# Altium project EPS_PCB.PrjPcb
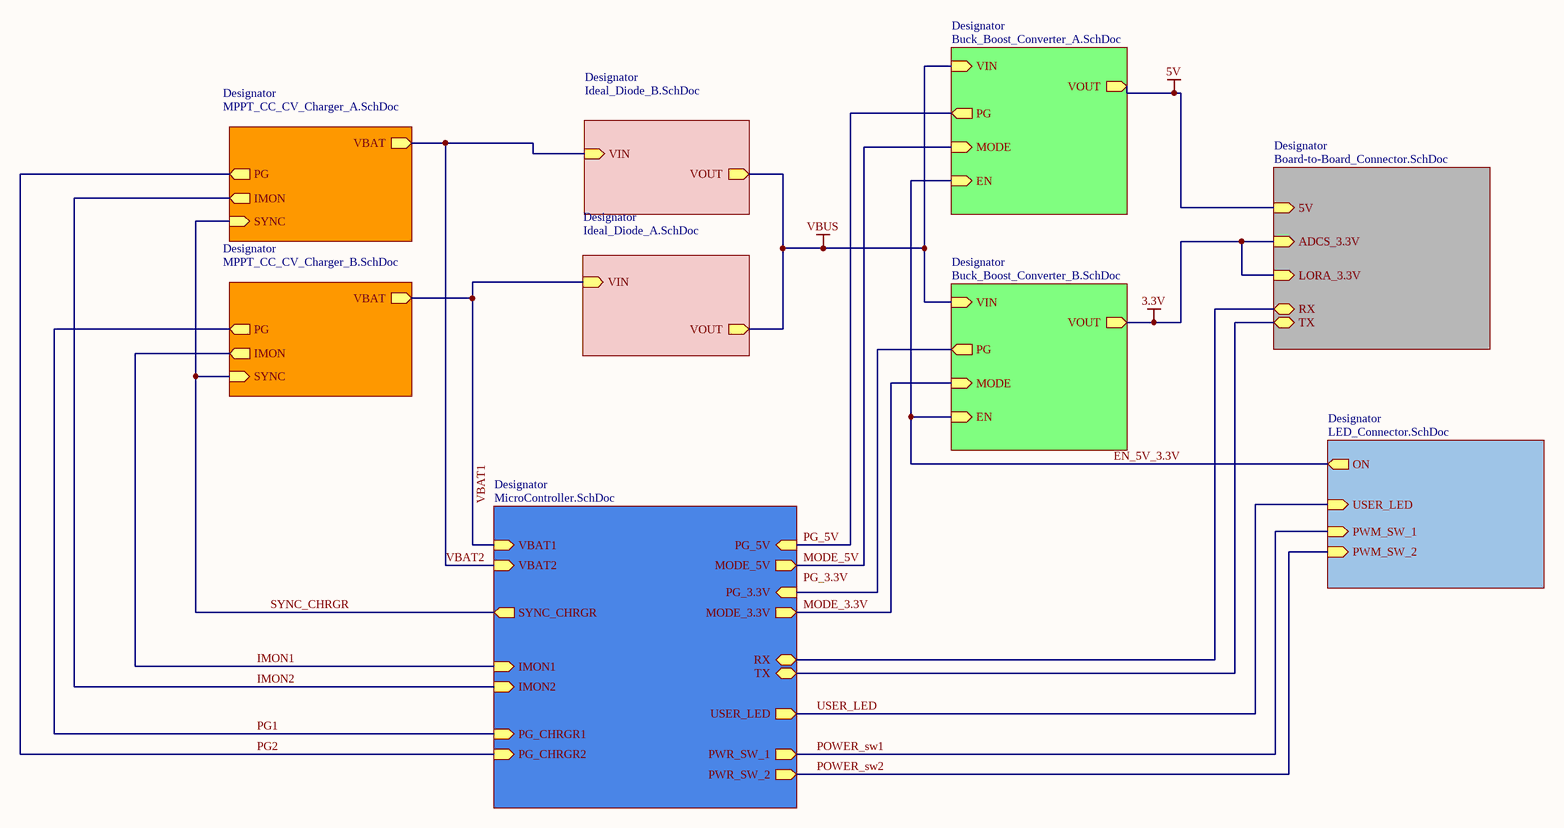
[diagram p0: Electrical_Power_System.SchDoc]
10 sheets, 119 parts. Net scope: hierarchical (ports join the sheet entries above them; power ports are global).
Board file: PCB1.PcbDoc
Sheets:
  Electrical_Power_System.SchDoc
    Designator = Board-to-Board_Connector.SchDoc
    Designator = MPPT_CC_CV_Charger_A.SchDoc
    Designator = Ideal_Diode_B.SchDoc
    Designator = Ideal_Diode_A.SchDoc
    Designator = Buck_Boost_Converter_B.SchDoc
    Designator = LED_Connector.SchDoc
    Designator = MicroController.SchDoc
    Designator = Buck_Boost_Converter_A.SchDoc
    Designator = MPPT_CC_CV_Charger_B.SchDoc

## Sheet Electrical_Power_System.SchDoc
size 431 x 279 mm; SheetNumber: 1; SheetTotal: 10

### Sub-sheets
Designator = Board-to-Board_Connector.SchDoc: 5V (in), ADCS_3.3V (in), LORA_3.3V (in), RX (bidir), TX (bidir)
Designator = MPPT_CC_CV_Charger_A.SchDoc: PG (out), IMON (out), SYNC (in), VBAT (out)
Designator = Ideal_Diode_B.SchDoc: VIN (in), VOUT (out)
Designator = Ideal_Diode_A.SchDoc: VIN (in), VOUT (out)
Designator = Buck_Boost_Converter_B.SchDoc: VIN (in), PG (out), MODE (in), EN (in), VOUT (out)
Designator = LED_Connector.SchDoc: ON (out), USER_LED (in), PWM_SW_1 (in), PWM_SW_2 (in)
Designator = MicroController.SchDoc: TX (bidir), RX (bidir), VBAT1 (in), VBAT2 (in), SYNC_CHRGR (out), IMON1 (in), IMON2 (in), PG_CHRGR1 (in), PG_CHRGR2 (in), PG_5V (in), MODE_5V (out), PG_3.3V (in), MODE_3.3V (out), USER_LED (out), PWR_SW_1 (out), PWR_SW_2 (out)
Designator = Buck_Boost_Converter_A.SchDoc: VIN (in), PG (out), MODE (in), EN (in), VOUT (out)
Designator = MPPT_CC_CV_Charger_B.SchDoc: PG (out), IMON (out), SYNC (in), VBAT (out)

### Nets
3.3V: sheet Designator/ADCS_3.3V, sheet Designator/LORA_3.3V, sheet Designator/VOUT
5V: sheet Designator/5V, sheet Designator/VOUT
VBUS: sheet Designator/VOUT, sheet Designator/VOUT, sheet Designator/VIN, sheet Designator/VIN
EN_5V_3.3V: sheet Designator/EN, sheet Designator/ON, sheet Designator/EN
IMON1: sheet Designator/IMON1, sheet Designator/IMON
IMON2: sheet Designator/IMON, sheet Designator/IMON2
MODE_3.3V: sheet Designator/MODE, sheet Designator/MODE_3.3V
MODE_5V: sheet Designator/MODE_5V, sheet Designator/MODE
PG1: sheet Designator/PG_CHRGR1, sheet Designator/PG  [project net PG]
PG2: sheet Designator/PG, sheet Designator/PG_CHRGR2  [project net PG]
PG_5V: sheet Designator/PG_5V, sheet Designator/PG
POWER_sw1: sheet Designator/PWM_SW_1, sheet Designator/PWR_SW_1
POWER_sw2: sheet Designator/PWM_SW_2, sheet Designator/PWR_SW_2
SYNC_CHRGR: sheet Designator/SYNC, sheet Designator/SYNC_CHRGR, sheet Designator/SYNC
USER_LED: sheet Designator/USER_LED, sheet Designator/USER_LED
VBAT1: sheet Designator/VIN, sheet Designator/VBAT1, sheet Designator/VBAT  [project net BIAS]
VBAT2: sheet Designator/VBAT, sheet Designator/VIN, sheet Designator/VBAT2  [project net BIAS]
NetP2_3: sheet Designator/TX, sheet Designator/TX
NetP2_4: sheet Designator/RX, sheet Designator/RX
NetU1_24: sheet Designator/PG, sheet Designator/PG_3.3V

### Notes on the sheet
- Labels drawn without touching a wire or pin: PG_3.3V
- DWG. NO.
- REV.
- SHT.
- THIS DOCUMENT AND THE DATA DISCLOSED HEREIN OR HEREWITH IS THE PROPERTY OF ALTIUM LIMITED AND MAY BE FREELY DISTRIBUTED IN WHOLE. NO RIGHTS ARE RESERVED OR EXPRESS OR IMPLIED WARANTEE GIVEN.
- REVISION
- DESCRIPTION
- DATE
- APPROVED
- ENG:
- APPROVALS
- PROJECT
- DSN:
- CHK:
- REFERENCE DOCUMENTS
- PROJECT REVISION:
- TITLE
- DOCUMENT REVISION:
- DESIGN ITEM:
- BOM:
- FAB DWG:
- PCB DWG:
- ASSY DWG:
- SCALE:
- SIZE
- B
- CAGE CODE
- FILE NAME
- DWG NO.
- SHEET
- OF
- REV

## Sheet Board-to-Board_Connector.SchDoc
size A4; SheetNumber: 8; SheetTotal: 9
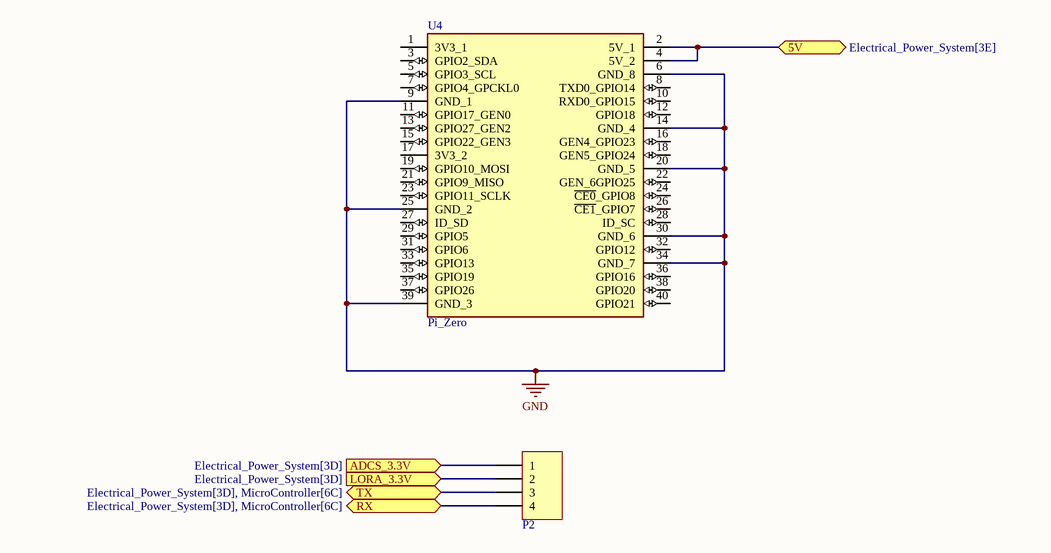
[diagram p1: Board-to-Board_Connector.SchDoc]

### Parts
P2  Header 4  [JP4]  (value not drawn)
U4  Pi_Zero  [MODULE_ADA3708]

### Ports
5V (bidir, see Electrical_Power_System[3E]), ADCS_3.3V (in, see Electrical_Power_System[3D]), LORA_3.3V (in, see Electrical_Power_System[3D]), RX (bidir, see Electrical_Power_System[3D], MicroController[6C]), TX (bidir, see Electrical_Power_System[3D], MicroController[6C])

### Nets
3.3V: P2.1 P2.2 ; port ADCS_3.3V, port LORA_3.3V
5V: U4.2(5V_1) U4.4(5V_2) ; port 5V
GND: U4.6(GND_8) U4.9(GND_1) U4.14(GND_4) U4.20(GND_5) U4.25(GND_2) U4.30(GND_6) U4.34(GND_7) U4.39(GND_3)
NetP2_3: P2.3 ; port TX
NetP2_4: P2.4 ; port RX

Not connected (* = marked no-connect by the designer): U4 1(3V3_1) 3(GPIO2_SDA) 5(GPIO3_SCL) 7(GPIO4_GPCKL0) 8(TXD0_GPIO14) 10(RXD0_GPIO15) 11(GPIO17_GEN0) 12(GPIO18) 13(GPIO27_GEN2) 15(GPIO22_GEN3) 16(GEN4_GPIO23) 17(3V3_2) 18(GEN5_GPIO24) 19(GPIO10_MOSI) 21(GPIO9_MISO) 22(GEN_6GPIO25) 23(GPIO11_SCLK) 24(~{CE0}_GPIO8) 26(~{CE1}_GPIO7) 27(ID_SD) 28(ID_SC) 29(GPIO5) 31(GPIO6) 32(GPIO12) 33(GPIO13) 35(GPIO19) 36(GPIO16) 37(GPIO26) 38(GPIO20) 40(GPIO21)

### Library data of the parts
P2 = Header 4: Header, 4-Pin; LatestRevisionDate: 17-Jul-2002; LatestRevisionNote: Re-released for DXP Platform.; Publisher: Altium Limited
U4 = Pi_Zero: Raspberry Pi Zero WH (Zero W with Headers); MF: Adafruit Industries; MP: ADA3708; SnapEDA_Link: https://www.snapeda.com/parts/ADA3708/Adafruit+Industries+LLC/view-part/?ref=snap; Package: None; Value: *; Check_prices: https://www.snapeda.com/parts/ADA3708/Adafruit+Industries+LLC/view-part/?ref=eda

## Sheet MPPT_CC_CV_Charger_A.SchDoc
size A4; SheetNumber: 4; SheetTotal: 10
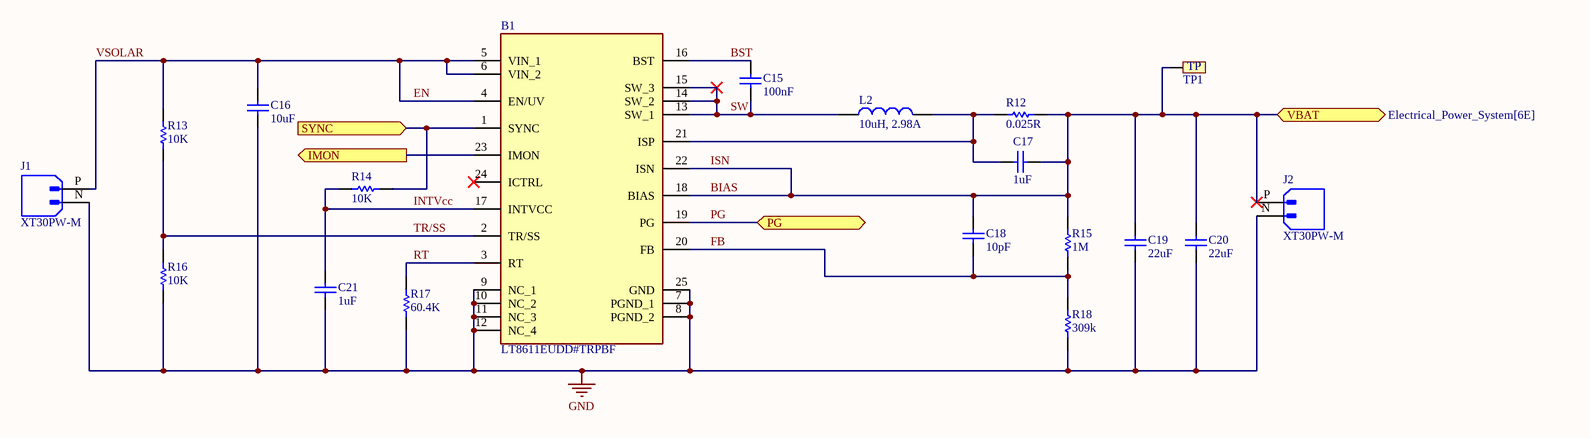
[diagram p2: MPPT_CC_CV_Charger_A.SchDoc]

### Parts
B1  LT8611EUDD#TRPBF  [QFN50P300X500X80-25N-D]
C15  value 100nF  [CAP-SM-0603]  (hidden comment: Cap Non-Pol SMD)
C16  value 10uF  [CAP-SM-0603]  (hidden comment: Cap Non-Pol SMD)
C17  value 1uF  [CAP-SM-0603]  (hidden comment: Cap Non-Pol SMD)
C18  value 10pF  [CAP-SM-0603]  (hidden comment: Cap Non-Pol SMD)
C19  value 22uF  [CAP-SM-0603]  (hidden comment: Cap Non-Pol SMD)
C20  value 22uF  [CAP-SM-0603]  (hidden comment: Cap Non-Pol SMD)
C21  value 1uF  [CAP-SM-0603]  (hidden comment: Cap Non-Pol SMD)
J1  XT30PW-M  [AMASS_XT30PW-M]
J2  XT30PW-M  [AMASS_XT30PW-M]
L2  10uH, 2.98A  [WE-PD2A_1054]
R12  value 0.025R  [RES-SM-0603]  (hidden comment: RESISTOR SMD)
R13  value 10K  [RES-SM-0603]  (hidden comment: RESISTOR SMD)
R14  value 10K  [RES-SM-0603]  (hidden comment: RESISTOR SMD)
R15  value 1M  [RES-SM-0603]  (hidden comment: RESISTOR SMD)
R16  value 10K  [RES-SM-0603]  (hidden comment: RESISTOR SMD)
R17  value 60.4K  [RES-SM-0603]  (hidden comment: RESISTOR SMD)
R18  value 309k  [RES-SM-0603]  (hidden comment: RESISTOR SMD)
TP1  Test Point  [TP]  (value not drawn)

### Ports
IMON (out, see Electrical_Power_System[7E]), PG (bidir, see Electrical_Power_System[7E]), SYNC (in, see Electrical_Power_System[7D], MPPT_CC_CV_Charger_B[1B]), VBAT (bidir, see Electrical_Power_System[6E])

### Nets
GND: B1.7(PGND_1) B1.8(PGND_2) B1.9(NC_1) B1.10(NC_2) B1.11(NC_3) B1.12(NC_4) B1.25(GND) C16.1 C19.1 C20.1 C21.1 J1.N J2.N R16.1 R17.1 R18.1
BIAS: B1.18(BIAS) B1.22(ISN) C17.1 C18.2 C19.2 C20.2 J2.P R12.1 R15.2 TP1.TP1 ; port VBAT  [also labelled ISN]
BST: B1.16(BST) C15.2
EN: B1.4(EN/UV) B1.5(VIN_1) B1.6(VIN_2) C16.2 J1.P R13.2  [also labelled VSOLAR]
FB: B1.20(FB) C18.1 R15.1 R18.2
IMON2: B1.23(IMON) ; port IMON
INTVcc: B1.17(INTVCC) C21.2 R14.2
PG: B1.19(PG) ; port PG
RT: B1.3(RT) R17.2
SW: B1.13(SW_1) B1.14(SW_2) B1.15(SW_3) C15.1 L2.1
SYNC_CHRGR: B1.1(SYNC) R14.1 ; port SYNC
TR/SS: B1.2(TR/SS) R13.1 R16.2
NetB1_21: B1.21(ISP) C17.2 L2.2 R12.2

Not connected (* = marked no-connect by the designer): B1 24(ICTRL)*

### Notes on the sheet
- (in symbol Test Point) TP

### Library data of the parts
B1 = LT8611EUDD#TRPBF: 42V, 2.5A Synchronous Step-Down Regulator with Current Sense and 2.5uA Quiescent Current; Manufacturer_Name: Analog Devices; Geometry.Height: 0.8mm; Mouser Part Number: 584-LT8611EUDD#TRPBF; Mouser Price/Stock: https://www.mouser.co.uk/ProductDetail/Analog-Devices/LT8611EUDDTRPBF?qs=hVkxg5c3xu8xYINPiSHe4g%3D%3D; Manufacturer_Part_Number: LT8611EUDD#TRPBF; Datasheet Link: https://www.analog.com/LT8611/datasheet
C15-C21 = Cap Non-Pol SMD: Capacitor
J1 J2 = XT30PW-M: Socket; DC supply; XT30; male; PIN: 2; on PCBs; THT; Colour: yellow; MF: AMASS; SnapEDA_Link: https://www.snapeda.com/parts/XT30PW-M/AMASS/view-part/?ref=snap; Package: None; Value: *; MP: XT30PW-M; Check_prices: https://www.snapeda.com/parts/XT30PW-M/AMASS/view-part/?ref=eda
L2 = 78477610: WE-PD2A SMT Power Inductor, size 1054, 10uH, 2.98A; Manufacturer: Wurth Elektronik; DC Resistance max.: 0.06Ohm; Saturation Current: 3.24A; Self Resonant Frequency: 27.52MHz; DC Resistance typ.: 0.028Ohm; Rated Voltage: 80VDC; ComponentLink1Description: Datasheet; ComponentLink1URL: https://www.we-online.com/catalog/datasheet/78477610.pdf; Manufacturer Part Number: 78477610; Published Date: May 2020; Rated Current: 2.98A; Inductance: 10uH; Operating Temperature: -40 to +125degC; Packaging: Tape and Reel; Size: 1054; Supplier 1 URL: https://www.digikey.com/en/products/detail/w%C3%BCrth-elektronik/78477610/5168783?s=N4IgjCBcoGwJxVAYygMwIYBsDOBTANCAPZQDaIALAAxwDMdIAuoQA4AuUIAymwE4CWAOwDmIAL6EwAJjgRoIFJAw4CxMiADsYMBQAcTVh0jc%2BQ0RJBSqujYgVoseQiUjkwVAAQBWgBIGQ7JwAqoL8bADyqACyuOjYAK68uOKEVrr68orKTmqulgB0cLoeAIL%2BgcYhYZExcYnJYo1AA; Supplier 1 URL: https://www.mouser.vn/ProductDetail/Wurth-Elektronik/78477610?qs=sBf%2Fb4nBSlfmBIqyB8oiaA%3D%3D; Supplier 3 URL: N/A; Value: 10uH, 2.98A; Supplier 2 URL: N/A; LCSC Part #: N/A; Mount: SMD/SMT; Supplier 1: Mouser; Supplier 1 Part Number: 710-78477610; Supplier 2: Digi-Key; Supplier 2 Part Number: 732-6881-2-ND; Supplier 3: thegioiic; Supplier 3 Part Number: N/A
R12-R18 = RESISTOR SMD: Resistor

## Sheet Ideal_Diode_B.SchDoc
size A4; SheetNumber: 5; SheetTotal: 9
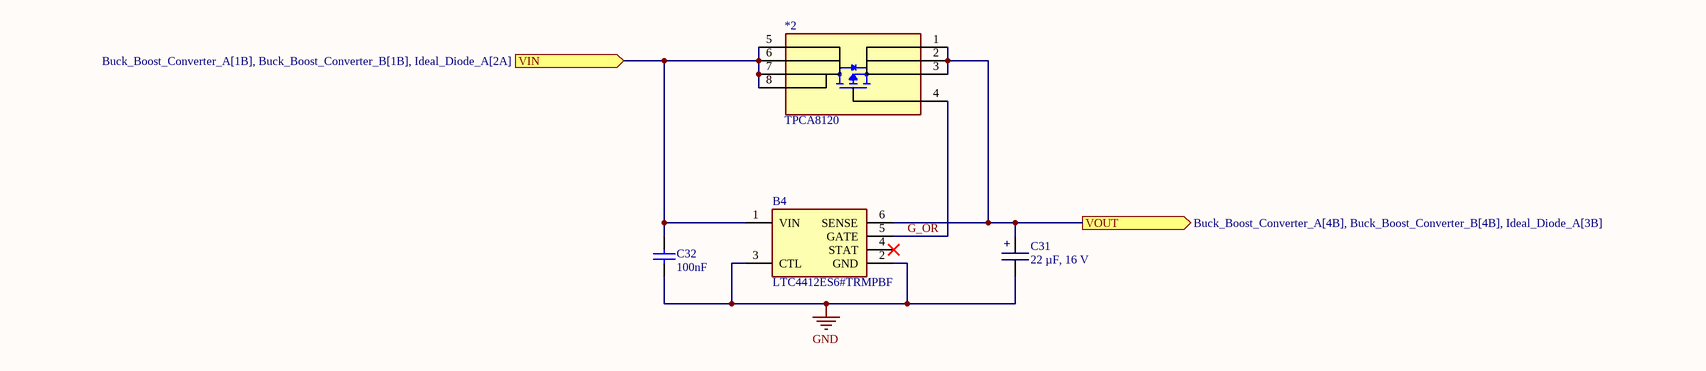
[diagram p3: Ideal_Diode_B.SchDoc]

### Parts
*2  TPCA8120  [TRANS_TPHR8504PL,L1Q]
B4  LTC4412ES6#TRMPBF  [SOT95P280X100-6N]
C31  22 µF, 16 V  [TANTALUM SMD C]
C32  value 100nF  [CAP-SM-0805]  (hidden comment: Cap Non-Pol SMD)

### Ports
VIN (in, see Buck_Boost_Converter_A[1B], Buck_Boost_Converter_B[1B], Ideal_Diode_A[2A]), VOUT (out, see Buck_Boost_Converter_A[4B], Buck_Boost_Converter_B[4B], Ideal_Diode_A[3B])

### Nets
GND: B4.2(GND) B4.3(CTL) C31.1 C32.1
VBUS: *2.1(S1) *2.2(S2) *2.3(S3) B4.6(SENSE) C31.2 ; port VOUT
BIAS: *2.5(D1) *2.6(D2) *2.7(D3) *2.8(D4) B4.1(VIN) C32.2 ; port VIN
G_OR: *2.4(G) B4.5(GATE)

Not connected (* = marked no-connect by the designer): B4 4(STAT)*

### Notes on the sheet
- (in symbol 01231222610) +

### Library data of the parts
B4 = LTC4412ES6: Hot Swap Controller LTC4412ES6#TRMPBF, Positive Voltage, 2.5  28 V, TSOT-23, 6-Pin; Manufacturer_Name: Analog Devices; Geometry.Height: 1mm; Mouser Part Number: 584-LTC4412ES6TRMPBF; Mouser Price/Stock: https://www.mouser.co.uk/ProductDetail/Analog-Devices/LTC4412ES6TRMPBF?qs=hVkxg5c3xu8vBeVp9%252BXk%252Bg%3D%3D; Manufacturer_Part_Number: LTC4412ES6#TRMPBF; Datasheet Link: http://cds.linear.com/docs/en/datasheet/4412fb.pdf
C31 = 01231222610: CAP TANT 22uF 10% 16V 2312; Manufacture  Name: KYOCERA AVX; Manufacture  SN: TAJC226K016RNJ; Capacitance Tolerance: +/-10%; ComponentLink1Description: Datasheet link; ComponentLink1URL: https://datasheets.kyocera-avx.com/TAJ.pdf; ComponentLink2Description: Supplier 1 URL; ComponentLink2URL: https://www.mouser.vn/ProductDetail/KYOCERA-AVX/TAJC226K016RNJ?qs=zt0pNtghXG%252B8PDA37tw3BQ%3D%3D; Size: 2312; Mounting Technology: SMT; Capacitance: 22uF; ComponentLink3Description: Supplier 2 URL; ComponentLink3URL: https://www.digikey.com/en/products/detail/kyocera-avx/TAJC226K016RNJ/1126827; ComponentLink4Description: Supplier 3 URL; ComponentLink4URL: https://www.thegioiic.com/tu-tantalum-22uf-16v-2312-tajc226k016rnj; Supplier 1 Name: Mouser; Supplier 1 SN: 581-TAJC226K016R; Supplier 1 URL: https://www.mouser.vn/ProductDetail/KYOCERA-AVX/TAJC226K016RNJ?qs=zt0pNtghXG%252B8PDA37tw3BQ%3D%3D; Supplier 2 Name: Digi-Key; Supplier 2 SN: 478-3899-1-ND; Supplier 2 URL: https://www.digikey.com/en/products/detail/kyocera-avx/TAJC226K016RNJ/1126827; Supplier 3 Name: thegioiic; Supplier 3 SN: N/A; Supplier 3 URL: https://www.thegioiic.com/tu-tantalum-22uf-16v-2312-tajc226k016rnj; Value: 22 µF, 16 V; Rated Voltage: 16 V
C32 = Cap Non-Pol SMD: Capacitor

## Sheet Ideal_Diode_A.SchDoc
size A4; SheetNumber: 6; SheetTotal: 10
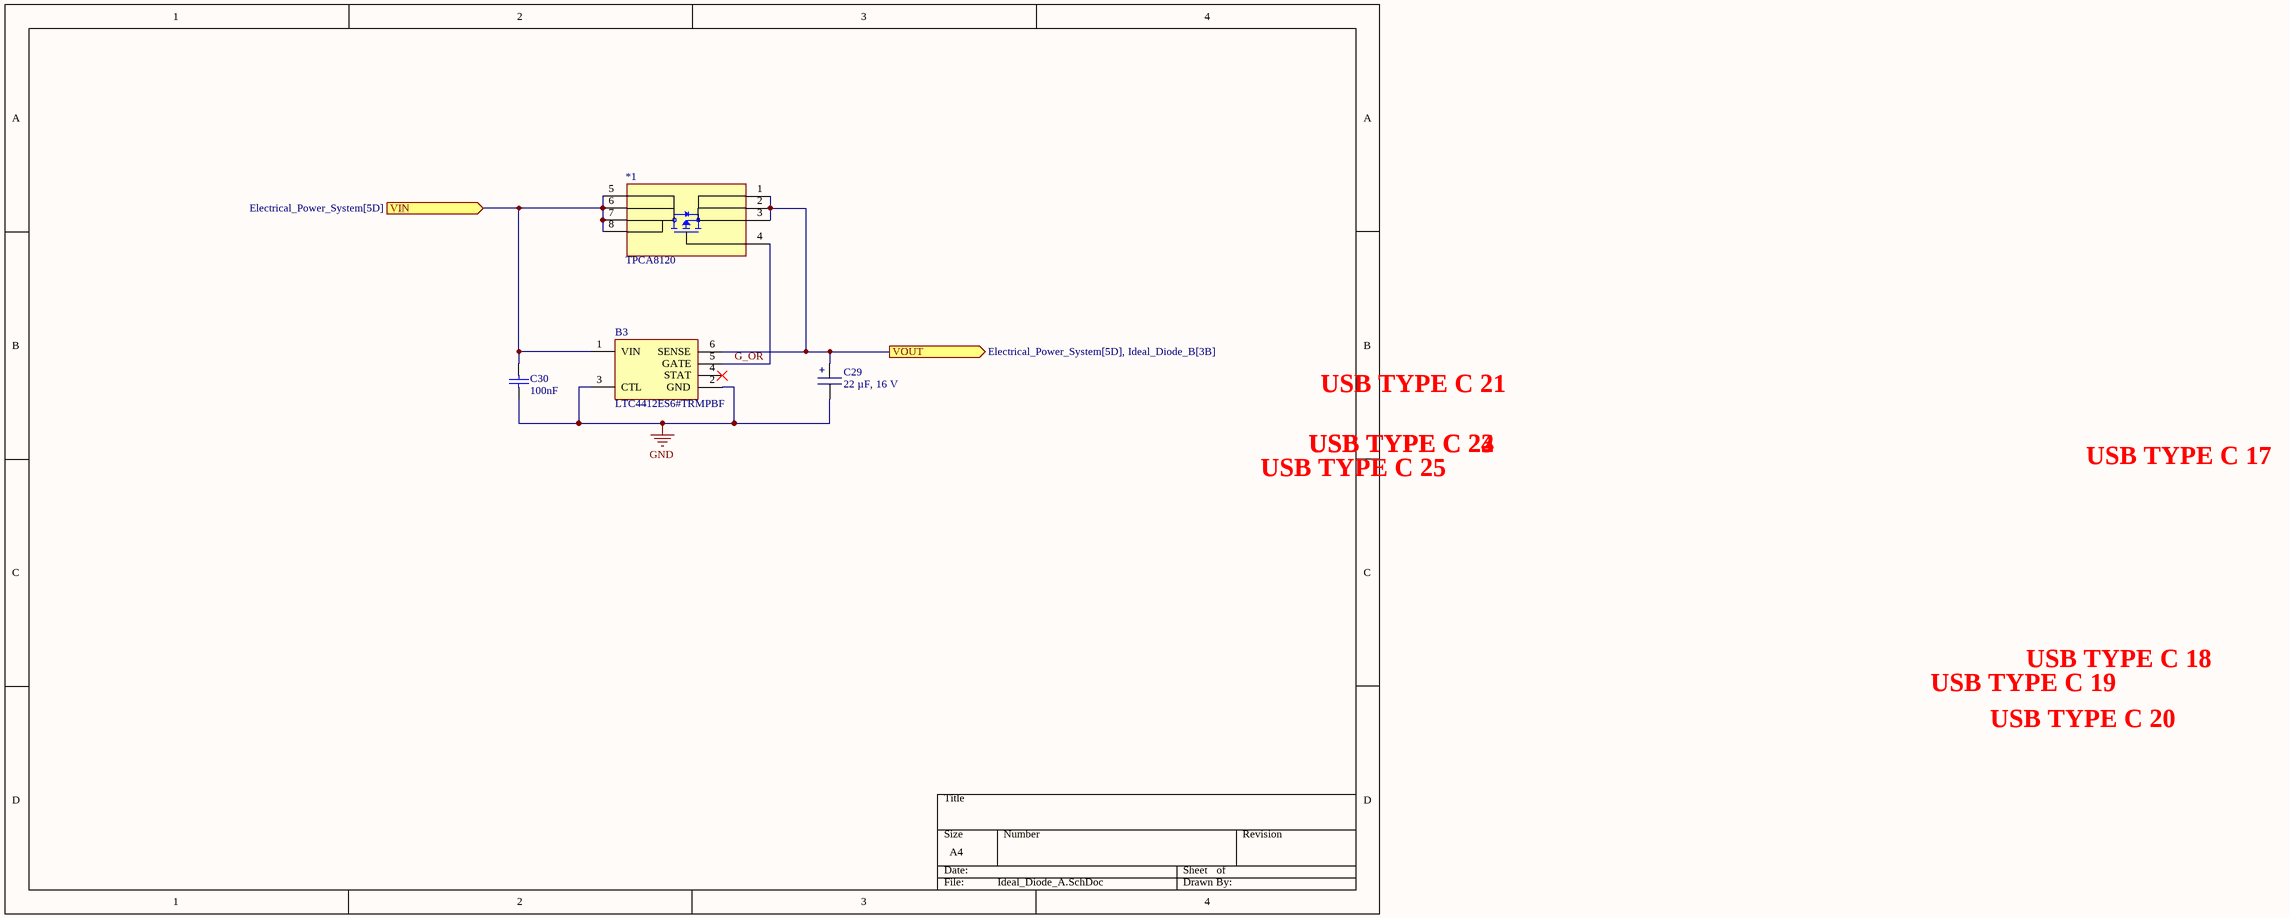
[diagram p4: Ideal_Diode_A.SchDoc]

### Parts
*1  TPCA8120  [TRANS_TPHR8504PL,L1Q]
B3  LTC4412ES6#TRMPBF  [SOT95P280X100-6N]
C29  22 µF, 16 V  [TANTALUM SMD C]
C30  value 100nF  [CAP-SM-0805]  (hidden comment: Cap Non-Pol SMD)

### Ports
VIN (in, see Electrical_Power_System[5D]), VOUT (out, see Electrical_Power_System[5D], Ideal_Diode_B[3B])

### Nets
GND: B3.2(GND) B3.3(CTL) C29.1 C30.1
VBUS: *1.1(S1) *1.2(S2) *1.3(S3) B3.6(SENSE) C29.2 ; port VOUT
BIAS: *1.5(D1) *1.6(D2) *1.7(D3) *1.8(D4) B3.1(VIN) C30.2 ; port VIN
G_OR: *1.4(G) B3.5(GATE)

Not connected (* = marked no-connect by the designer): B3 4(STAT)*

### Notes on the sheet
- USB TYPE C 21
- USB TYPE C 22
- USB TYPE C 23
- USB TYPE C 24
- USB TYPE C 25
- USB TYPE C 17
- USB TYPE C 19
- USB TYPE C 18
- USB TYPE C 20
- (in symbol 01231222610) +

### Library data of the parts
B3 = LTC4412ES6: as B4 on sheet Ideal_Diode_B; Mouser Part Number: 584-LTC4412ES6TRMPBF; Mouser Price/Stock: https://www.mouser.co.uk/ProductDetail/Analog-Devices/LTC4412ES6TRMPBF?qs=hVkxg5c3xu8vBeVp9%252BXk%252Bg%3D%3D; Manufacturer_Part_Number: LTC4412ES6#TRMPBF; Datasheet Link: http://cds.linear.com/docs/en/datasheet/4412fb.pdf
C29 = 01231222610: as C31 on sheet Ideal_Diode_B; ComponentLink1Description: Datasheet link; ComponentLink1URL: https://datasheets.kyocera-avx.com/TAJ.pdf; ComponentLink2Description: Supplier 1 URL; ComponentLink2URL: https://www.mouser.vn/ProductDetail/KYOCERA-AVX/TAJC226K016RNJ?qs=zt0pNtghXG%252B8PDA37tw3BQ%3D%3D; Size: 2312; Mounting Technology: SMT; Capacitance: 22uF; ComponentLink3Description: Supplier 2 URL; ComponentLink3URL: https://www.digikey.com/en/products/detail/kyocera-avx/TAJC226K016RNJ/1126827; ComponentLink4Description: Supplier 3 URL; ComponentLink4URL: https://www.thegioiic.com/tu-tantalum-22uf-16v-2312-tajc226k016rnj; Supplier 1 Name: Mouser; Supplier 1 SN: 581-TAJC226K016R; Supplier 1 URL: https://www.mouser.vn/ProductDetail/KYOCERA-AVX/TAJC226K016RNJ?qs=zt0pNtghXG%252B8PDA37tw3BQ%3D%3D; Supplier 2 Name: Digi-Key; Supplier 2 SN: 478-3899-1-ND; Supplier 2 URL: https://www.digikey.com/en/products/detail/kyocera-avx/TAJC226K016RNJ/1126827; Supplier 3 Name: thegioiic; Supplier 3 SN: N/A; Supplier 3 URL: https://www.thegioiic.com/tu-tantalum-22uf-16v-2312-tajc226k016rnj; Value: 22 µF, 16 V; Rated Voltage: 16 V
C30 = Cap Non-Pol SMD: Capacitor

## Sheet Buck_Boost_Converter_B.SchDoc
size A4; SheetNumber: 8; SheetTotal: 10
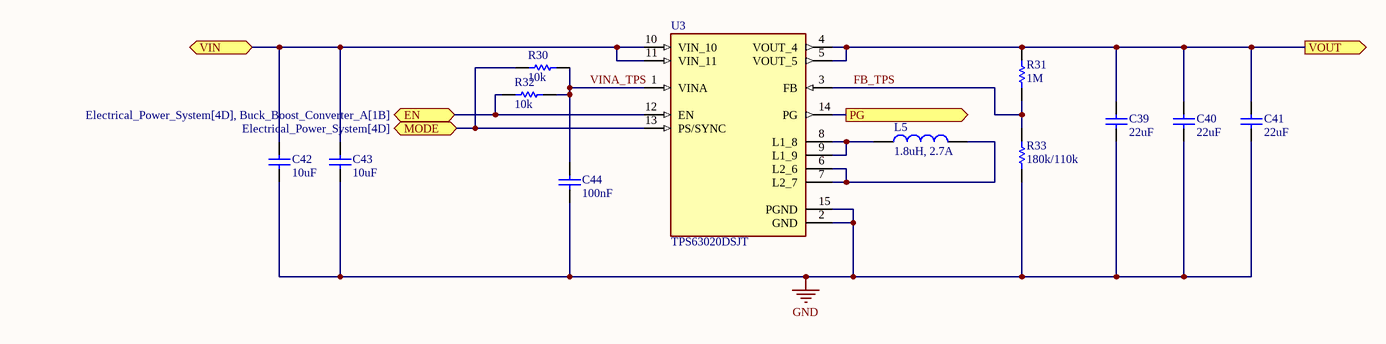
[diagram p5: Buck_Boost_Converter_B.SchDoc]

### Parts
C39  value 22uF  [CAP-SM-0603]  (hidden comment: Cap Non-Pol SMD)
C40  value 22uF  [CAP-SM-0603]  (hidden comment: Cap Non-Pol SMD)
C41  value 22uF  [CAP-SM-0603]  (hidden comment: Cap Non-Pol SMD)
C42  value 10uF  [CAP-SM-0603]  (hidden comment: Cap Non-Pol SMD)
C43  value 10uF  [CAP-SM-0603]  (hidden comment: Cap Non-Pol SMD)
C44  value 100nF  [CAP-SM-0603]  (hidden comment: Cap Non-Pol SMD)
L5  1.8uH, 2.7A  [WE-PD2A_4532]
R30  value 10k  [RES-SM-0603]  (hidden comment: RESISTOR SMD)
R31  value 1M  [RES-SM-0603]  (hidden comment: RESISTOR SMD)
R32  value 10k  [RES-SM-0603]  (hidden comment: RESISTOR SMD)
R33  value 180k/110k  [RES-SM-0603]  (hidden comment: RESISTOR SMD)
U3  TPS63020DSJT  [IC_TPS63020DSJT]

### Ports
EN (bidir, see Electrical_Power_System[4D], Buck_Boost_Converter_A[1B]), MODE (bidir, see Electrical_Power_System[4D]), PG (out, see Electrical_Power_System[4D]), VIN (bidir, see Electrical_Power_System[4D], Buck_Boost_Converter_A[1B]), VOUT (out, see Electrical_Power_System[3D])

### Nets
3.3V: C39.2 C40.2 C41.2 R31.2 U3.4(VOUT_4) U3.5(VOUT_5) ; port VOUT
GND: C39.1 C40.1 C41.1 C42.1 C43.1 C44.1 R33.1 U3.2(GND) U3.15(PGND)
VBUS: C42.2 C43.2 U3.10(VIN_10) U3.11(VIN_11) ; port VIN
EN_5V_3.3V: R32.2 U3.12(EN) ; port EN
FB_TPS: R31.1 R33.2 U3.3(FB)
MODE_3.3V: R30.2 U3.13(PS/SYNC) ; port MODE
VINA_TPS: C44.2 R30.1 R32.1 U3.1(VINA)
NetL5_1: L5.1 U3.8(L1_8) U3.9(L1_9)
NetL5_2: L5.2 U3.6(L2_6) U3.7(L2_7)
NetU1_24: U3.14(PG) ; port PG

### Library data of the parts
C39-C44 = Cap Non-Pol SMD: Capacitor
L5 = 784773018: WE-PD2A SMT Power Inductor, size 4532, 1.8uH, 2.7A; Manufacturer: Wurth Elektronik; DC Resistance max.: 0.064Ohm; Saturation Current: 3.6A; Self Resonant Frequency: 85MHz; DC Resistance typ.: 0.028Ohm; Rated Voltage: 80VDC; ComponentLink1Description: Datasheet; ComponentLink1URL: https://www.we-online.com/catalog/datasheet/784773018.pdf; Manufacturer Part Number: 784773018; Published Date: May 2020; Rated Current: 2.7A; Inductance: 1.8uH; Operating Temperature: -40 to +125degC; Packaging: Tape and Reel; Size: 4532; Supplier 2 URL: https://www.digikey.com/en/products/detail/w%C3%BCrth-elektronik/784773018/5168841?s=N4IgTCBcDaIOwA4Asc4GYAMBGBIC6AvkA; Supplier 1 URL: https://www.mouser.vn/ProductDetail/Wurth-Elektronik/784773018?qs=sBf%2Fb4nBSleQ5H1IVXBHSg%3D%3D; Supplier 3 URL: N/A; Value: 1.8uH, 2.7A; LCSC Part #: N/A; Supplier 1: Mouser; Supplier 1 Part Number: 710-784773018; Supplier 2: Digi-Key; Supplier 2 Part Number: 732-6804-2-ND; Supplier 3: thegioiic; Supplier 3 Part Number: N/A; Mount: SMD/SMT
R30-R33 = RESISTOR SMD: Resistor
U3 = TPS63020DSJT: High Efficiency Single Inductor Buck-Boost Converter with 4A Switch 14-VSON -40 to 85; MF: Texas Instruments; Value: *; SnapEDA_Link: https://www.snapeda.com/parts/TPS63020DSJT/Texas%20Instruments/view-part/225125/?ref=snap; Texas_Instruments-Purchase-URL: https://snapeda.com/shop?store=Texas+Instruments&id=225125; Arrow_Asia-Purchase-URL: https://snapeda.com/shop?store=Arrow+Asia&id=225125; Mouser-Purchase-URL: https://snapeda.com/shop?store=Mouser&id=225125; Availability: Good; Price: None; Package: VSON-14 Texas Instruments; DigiKey-Purchase-URL: https://snapeda.com/shop?store=DigiKey&id=225125; MP: TPS63020DSJT

## Sheet LED_Connector.SchDoc
size A4; SheetNumber: 10; SheetTotal: 10
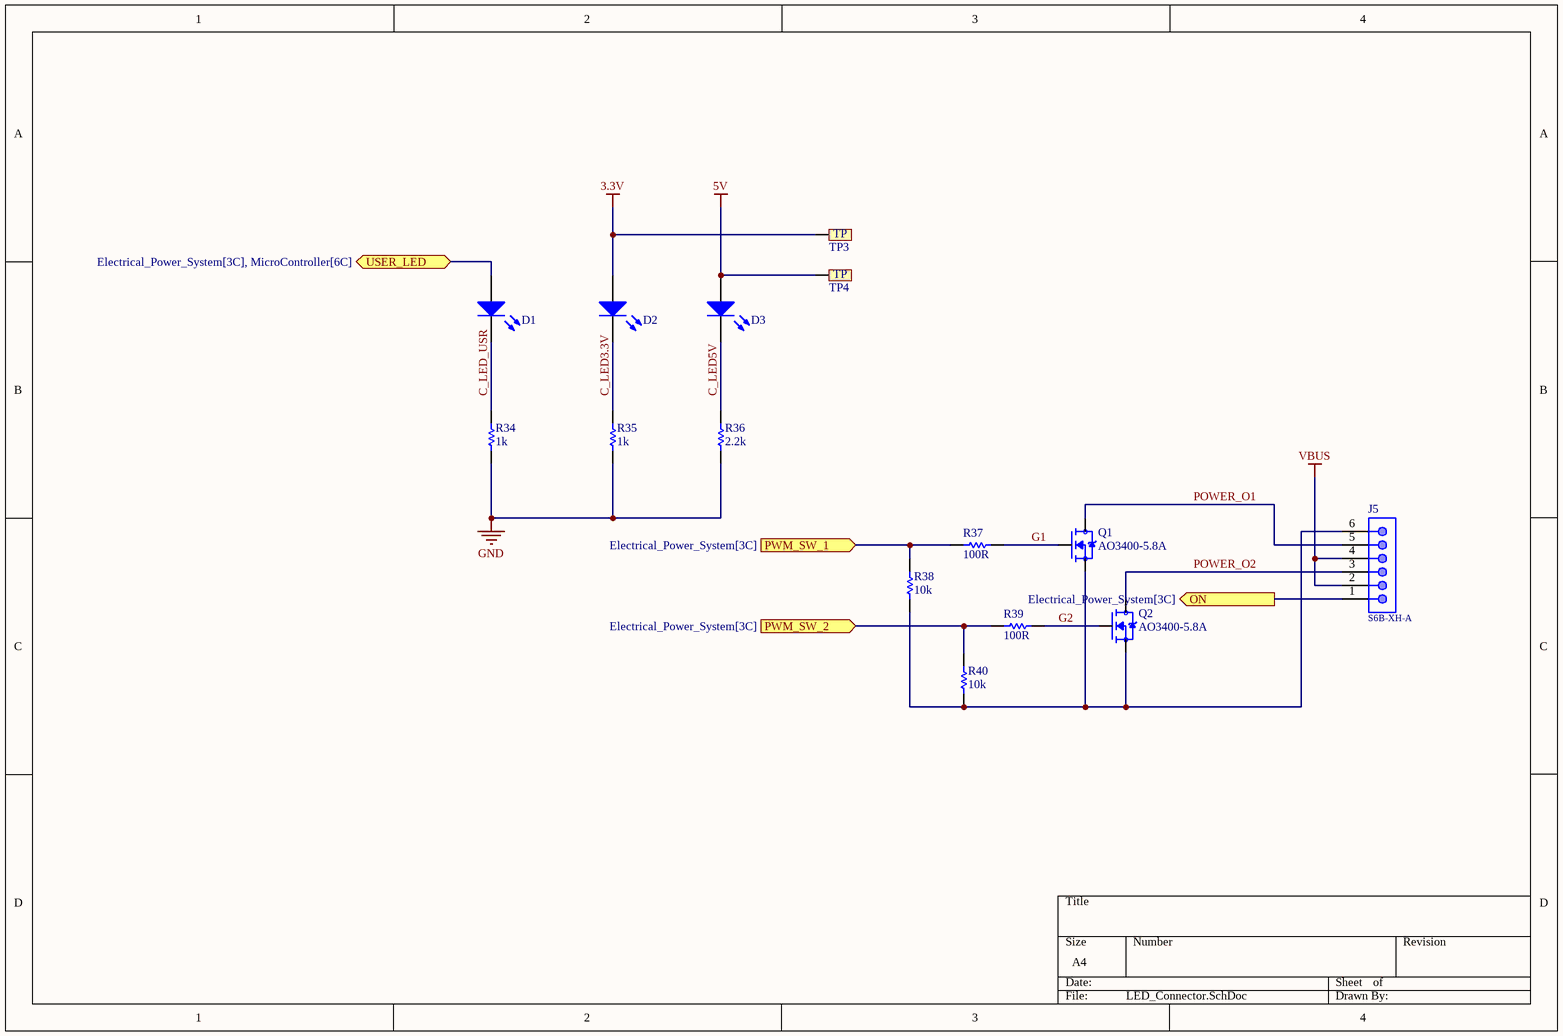
[diagram p6: LED_Connector.SchDoc]

### Parts
D1  LED SMD  [LED_0805_Blue]  (value not drawn)
D2  LED SMD  [LED_0805_Blue]  (value not drawn)
D3  LED SMD  [LED_0805_Blue]  (value not drawn)
J5  S6B-XH-A  [S6B-XH-A]
Q1  AO3400-5.8A  [SOT95P260X140-3N]
Q2  AO3400-5.8A  [SOT95P260X140-3N]
R34  value 1k  [RES-SM-0805]  (hidden comment: RESISTOR SMD)
R35  value 1k  [RES-SM-0805]  (hidden comment: RESISTOR SMD)
R36  value 2.2k  [RES-SM-0805]  (hidden comment: RESISTOR SMD)
R37  value 100R  [RES-SM-0805]  (hidden comment: RESISTOR SMD)
R38  value 10k  [RES-SM-0805]  (hidden comment: RESISTOR SMD)
R39  value 100R  [RES-SM-0805]  (hidden comment: RESISTOR SMD)
R40  value 10k  [RES-SM-0805]  (hidden comment: RESISTOR SMD)
TP3  Test Point  [TP]  (value not drawn)
TP4  Test Point  [TP]  (value not drawn)

### Ports
ON (out, see Electrical_Power_System[3C]), PWM_SW_1 (in, see Electrical_Power_System[3C]), PWM_SW_2 (in, see Electrical_Power_System[3C]), USER_LED (bidir, see Electrical_Power_System[3C], MicroController[6C])

### Nets
3.3V: D2.1(A) TP3.TP1
5V: D3.1(A) TP4.TP1
GND: R34.2 R35.2 R36.2
VBUS: J5.2 J5.4
C_LED3.3V: D2.2(K) R35.1
C_LED5V: D3.2(K) R36.1
C_LED_USR: D1.2(K) R34.1
EN_5V_3.3V: J5.1 ; port ON
G1: Q1.1(G) R37.2
G2: Q2.1(G) R39.2
POWER_O1: J5.5 Q1.3(D)
POWER_O2: J5.3 Q2.3(D)
POWER_sw1: R37.1 R38.1 ; port PWM_SW_1
POWER_sw2: R39.1 R40.1 ; port PWM_SW_2
USER_LED: D1.1(A) ; port USER_LED
NetJ5_6: J5.6 Q1.2(S) Q2.2(S) R38.2 R40.2

### Notes on the sheet
- (in symbol Test Point) TP

### Library data of the parts
D1-D3 = LED SMD: LED
J5 = S6B-XH-A: WR-PHD Pin Header, THT, pitch 2.54mm, Single Row, Angled, 6p; Manufacturer Part Number: 61300611021; Manufacturer: Wurth Elektronik; Pin Number: 6; Rated Current: 3A; Working Voltage: 250VAC; Withstanding Voltage: 500VAC; Contact Resistance: 20mOhm; Supply Name 1: Mouser; ComponentLink1Description: Manufacturer; ComponentLink1URL: http://www.we-online.de; ComponentLink2Description: Datasheet; ComponentLink2URL: https://www.we-online.com/catalog/datasheet/61300611021.pdf; Published Date: May 2020; Pitch: 2.54mm; Operating Temperature: -40 to +105degC; Mounting Technology: THT; Packaging: Bag; Gender: Pin Header; Row Number: Single; Orientation: Angled; ComponentLink3Description: Global Supply; ComponentLink3URL: https://www.we-online.com/en/components/products/PHD_2_54_THT_ANGLED_PIN_HEADER_6130XX11021?sq=61300611021#61300611021; ComponentLink4Description: Global Supply; ComponentLink4URL: https://www.mouser.vn/ProductDetail/Wurth-Elektronik/61300611021?qs=PhR8RmCirEaego3UjbXiZA%3D%3D; Supplier 1 Name: Mouser; Supplier 1 SN: 710-61300611021; Supplier 1 URL: https://www.mouser.vn/ProductDetail/Wurth-Elektronik/61300611021?qs=PhR8RmCirEaego3UjbXiZA%3D%3D; Supplier 2 Name: Digi-Key; Supplier 2 SN: N/A; Supplier 2 URL: N/A; Supplier 3 Name: thegioiic; Supplier 3 SN: N/A; Supplier 3 URL: N/A
Q1 Q2 = AO3400-5.8A: N-Channel 30 V 5.8A (Ta) 1.5W (Ta) Surface Mount SOT-23; MF: MDD; Check_prices: https://www.snapeda.com/parts/AO3400-5.8A/MDD/view-part/?ref=eda; Value: *; Availability: In Stock; MP: AO3400-5.8A; Price: None; Package: None; SnapEDA_Link: https://www.snapeda.com/parts/AO3400-5.8A/MDD/view-part/?ref=snap; Purchase-URL: https://pricing.snapeda.com/search/part/AO3400-5.8A/?ref=eda
R34-R40 = RESISTOR SMD: Resistor

## Sheet MicroController.SchDoc
size 431 x 279 mm; SheetNumber: 2; SheetTotal: 10
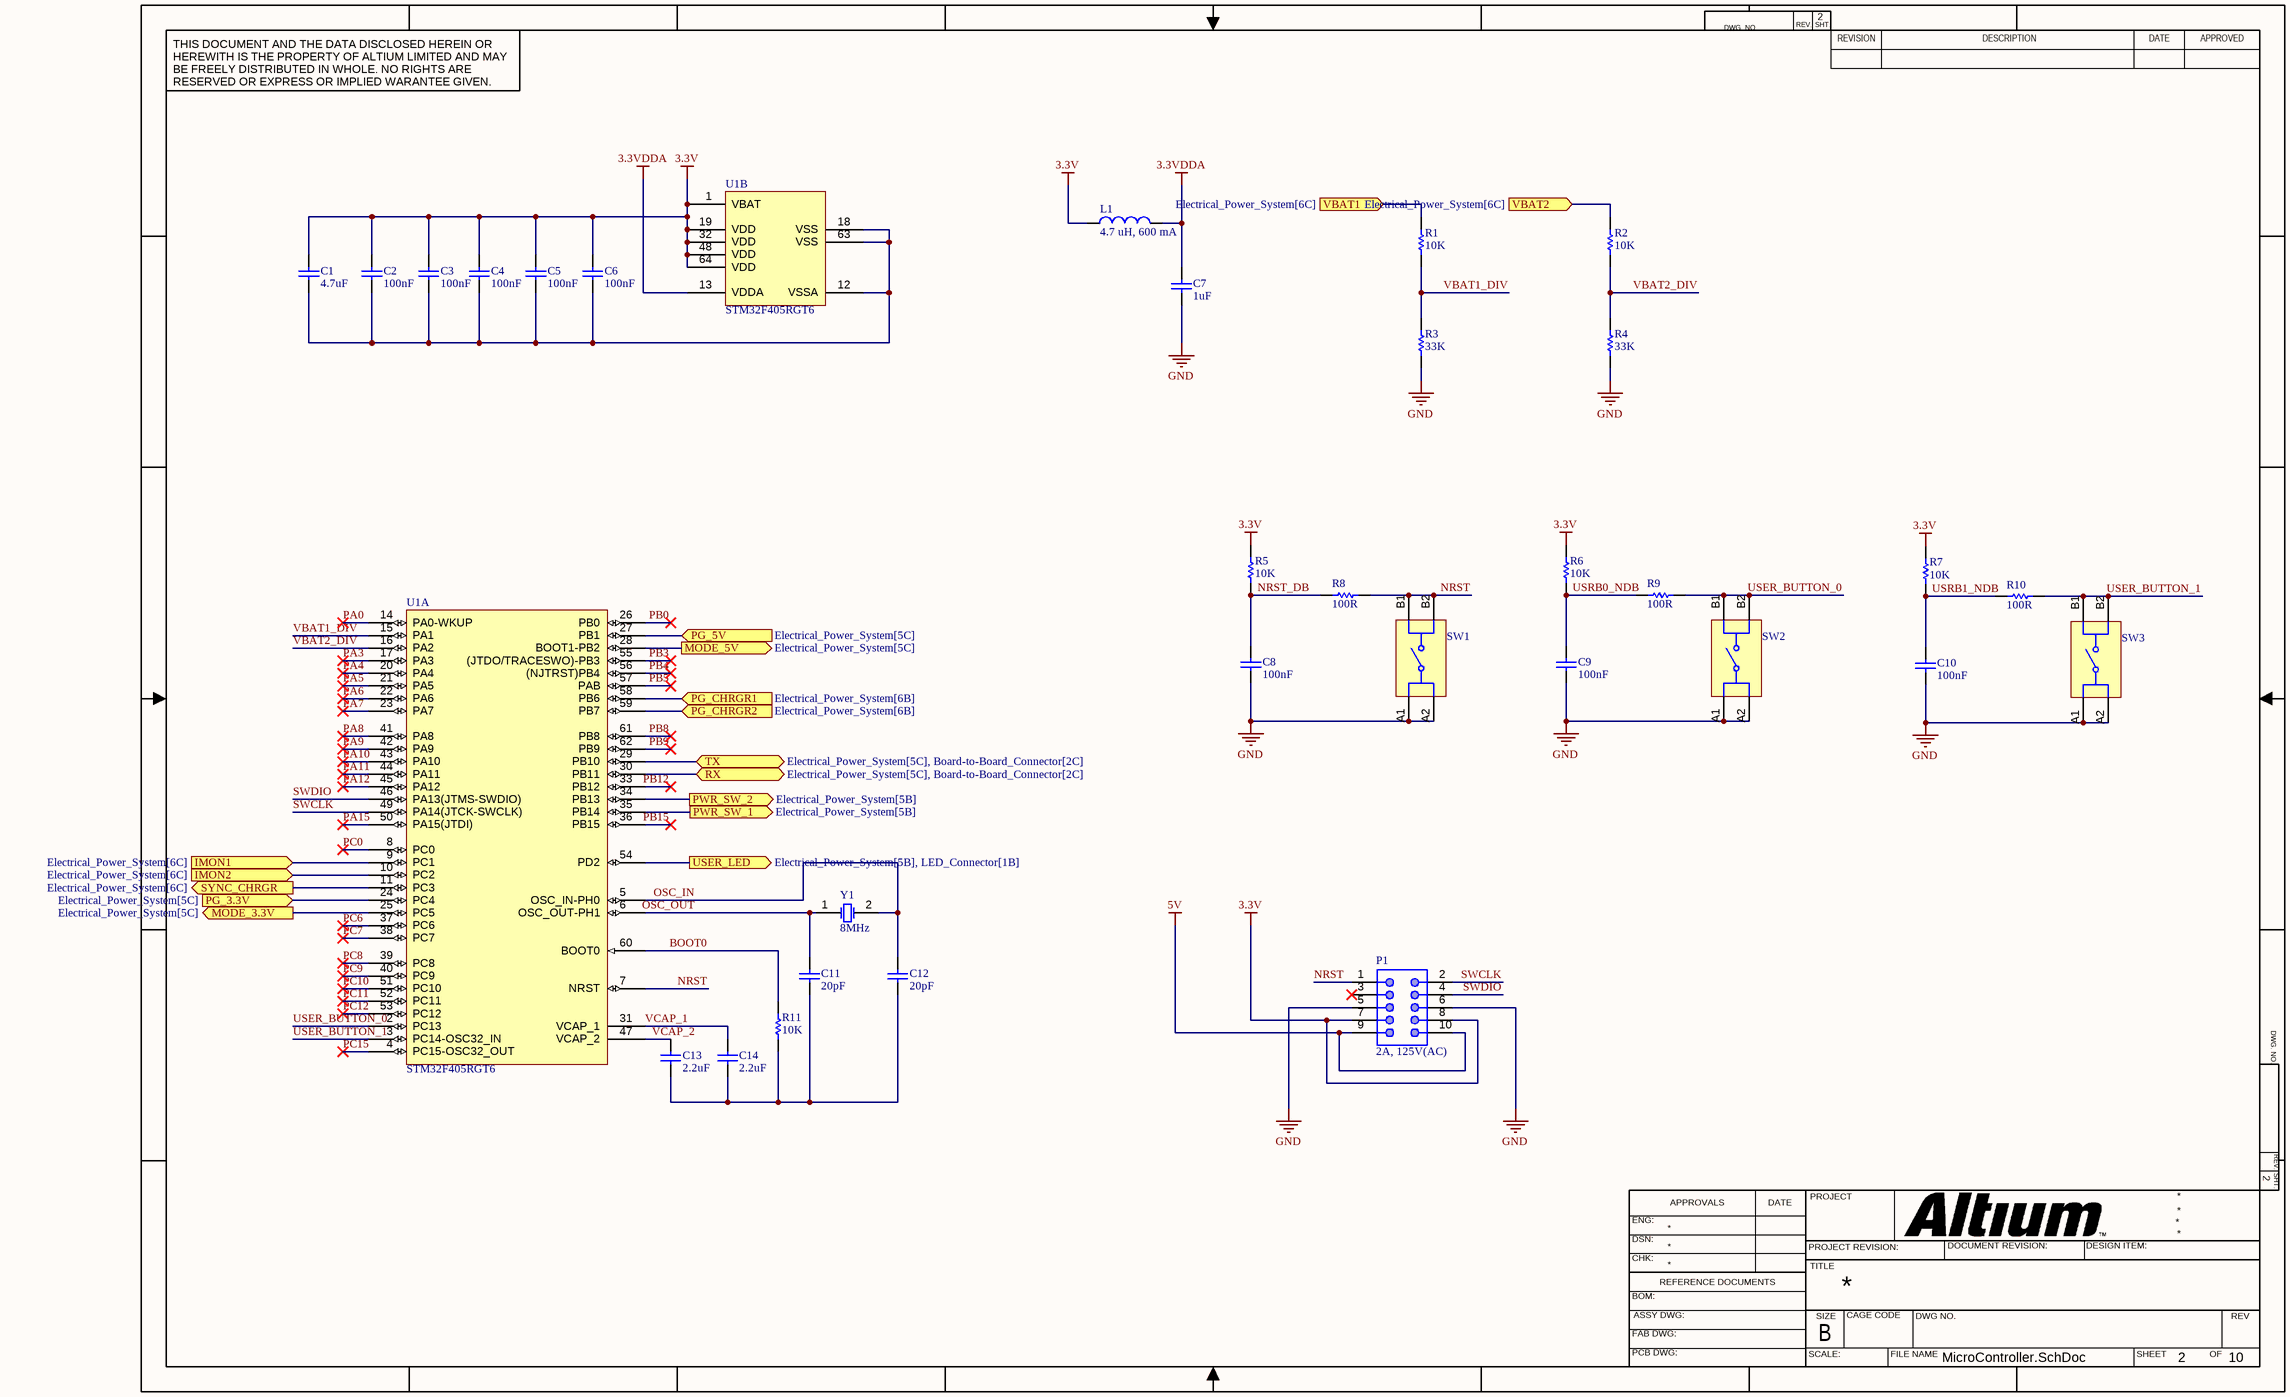
[diagram p7: MicroController.SchDoc]

### Parts
C1  value 4.7uF  [CAP-SM-0603]  (hidden comment: Cap Non-Pol SMD)
C2  value 100nF  [CAP-SM-0603]  (hidden comment: Cap Non-Pol SMD)
C3  value 100nF  [CAP-SM-0603]  (hidden comment: Cap Non-Pol SMD)
C4  value 100nF  [CAP-SM-0603]  (hidden comment: Cap Non-Pol SMD)
C5  value 100nF  [CAP-SM-0603]  (hidden comment: Cap Non-Pol SMD)
C6  value 100nF  [CAP-SM-0603]  (hidden comment: Cap Non-Pol SMD)
C7  value 1uF  [CAP-SM-0603]  (hidden comment: Cap Non-Pol SMD)
C8  value 100nF  [CAP-SM-0805]  (hidden comment: Cap Non-Pol SMD)
C9  value 100nF  [CAP-SM-0805]  (hidden comment: Cap Non-Pol SMD)
C10  value 100nF  [CAP-SM-0805]  (hidden comment: Cap Non-Pol SMD)
C11  value 20pF  [CAP-SM-0603]  (hidden comment: Cap Non-Pol SMD)
C12  value 20pF  [CAP-SM-0603]  (hidden comment: Cap Non-Pol SMD)
C13  value 2.2uF  [CAP-SM-0603]  (hidden comment: Cap Non-Pol SMD)
C14  value 2.2uF  [CAP-SM-0603]  (hidden comment: Cap Non-Pol SMD)
L1  4.7 uH, 600 mA  [0805]
P1  2A, 125V(AC)  [62401021722]
R1  value 10K  [RES-SM-0805]  (hidden comment: RESISTOR SMD)
R2  value 10K  [RES-SM-0805]  (hidden comment: RESISTOR SMD)
R3  value 33K  [RES-SM-0805]  (hidden comment: RESISTOR SMD)
R4  value 33K  [RES-SM-0805]  (hidden comment: RESISTOR SMD)
R5  value 10K  [RES-SM-0805]  (hidden comment: RESISTOR SMD)
R6  value 10K  [RES-SM-0805]  (hidden comment: RESISTOR SMD)
R7  value 10K  [RES-SM-0805]  (hidden comment: RESISTOR SMD)
R8  value 100R  [RES-SM-0805]  (hidden comment: RESISTOR SMD)
R9  value 100R  [RES-SM-0805]  (hidden comment: RESISTOR SMD)
R10  value 100R  [RES-SM-0805]  (hidden comment: RESISTOR SMD)
R11  value 10K  [RES-SM-0805]  (hidden comment: RESISTOR SMD)
SW1  430152050826  [WS-TASV_L6W6H5_4301x20508x6]  (value not drawn)
SW2  430152050826  [WS-TASV_L6W6H5_4301x20508x6]  (value not drawn)
SW3  430152050826  [WS-TASV_L6W6H5_4301x20508x6]  (value not drawn)
U1  STM32F405RGT6  [STM32F405RGT6]  (parts A,B of 2)
Y1  8MHz  [WE-XTAL_HC49/4HSMX]

### Ports
IMON1 (in, see Electrical_Power_System[6C]), IMON2 (in, see Electrical_Power_System[6C]), MODE_3.3V (out, see Electrical_Power_System[5C]), MODE_5V (out, see Electrical_Power_System[5C]), PG_3.3V (in, see Electrical_Power_System[5C]), PG_5V (in, see Electrical_Power_System[5C]), PG_CHRGR1 (in, see Electrical_Power_System[6B]), PG_CHRGR2 (in, see Electrical_Power_System[6B]), PWR_SW_1 (out, see Electrical_Power_System[5B]), PWR_SW_2 (out, see Electrical_Power_System[5B]), RX (bidir, see Electrical_Power_System[5C], Board-to-Board_Connector[2C]), SYNC_CHRGR (out, see Electrical_Power_System[6C]), TX (bidir, see Electrical_Power_System[5C], Board-to-Board_Connector[2C]), USER_LED (out, see Electrical_Power_System[5B], LED_Connector[1B]), VBAT1 (in, see Electrical_Power_System[6C]), VBAT2 (in, see Electrical_Power_System[6C])

### Nets
3.3V: C1.2 C2.2 C3.2 C4.2 C5.2 C6.2 L1.1 P1.7 P1.8 R5.2 R6.2 R7.2 U1.1(VBAT) U1.19(VDD) U1.32(VDD) U1.48(VDD) U1.64(VDD)
3.3VDDA: C7.2 L1.2 U1.13(VDDA)
5V: P1.9 P1.10
GND: C7.1 C8.1 C9.1 C10.1 P1.5 P1.6 R3.1 R4.1 SW1.A1 SW1.A2 SW2.A1 SW2.A2 SW3.A1 SW3.A2
BIAS: R2.2 ; port VBAT2
BIAS: R1.2 ; port VBAT1  [a separate net that carries the same name]
BOOT0: R11.2 U1.60(BOOT0)
IMON1: U1.9(PC1) ; port IMON1
IMON2: U1.10(PC2) ; port IMON2
MODE_3.3V: U1.25(PC5) ; port MODE_3.3V
MODE_5V: U1.28(BOOT1-PB2) ; port MODE_5V
NRST: P1.1 R8.2 SW1.B1 SW1.B2 U1.7(NRST)
NRST_DB: C8.2 R5.1 R8.1
OSC_IN: C12.2 U1.5(OSC_IN-PH0) Y1.2(OSC2)
OSC_OUT: C11.2 U1.6(OSC_OUT-PH1) Y1.1(OSC1)
PA0: U1.14(PA0-WKUP)
PA3: U1.17(PA3)
PA4: U1.20(PA4)
PA5: U1.21(PA5)
PA6: U1.22(PA6)
PA7: U1.23(PA7)
PA8: U1.41(PA8)
PA9: U1.42(PA9)
PA10: U1.43(PA10)
PA11: U1.44(PA11)
PA12: U1.45(PA12)
PA15: U1.50(PA15(JTDI))
PB0: U1.26(PB0)
PB3: U1.55((JTDO/TRACESWO)-PB3)
PB4: U1.56((NJTRST)PB4)
PB5: U1.57(PAB)
PB8: U1.61(PB8)
PB9: U1.62(PB9)
PB12: U1.33(PB12)
PB15: U1.36(PB15)
PC0: U1.8(PC0)
PC6: U1.37(PC6)
PC7: U1.38(PC7)
PC8: U1.39(PC8)
PC9: U1.40(PC9)
PC10: U1.51(PC10)
PC11: U1.52(PC11)
PC12: U1.53(PC12)
PC15: U1.4(PC15-OSC32_OUT)
PG: U1.59(PB7) ; port PG_CHRGR2
PG: U1.58(PB6) ; port PG_CHRGR1  [a separate net that carries the same name]
PG_5V: U1.27(PB1) ; port PG_5V
POWER_sw1: U1.35(PB14) ; port PWR_SW_1
POWER_sw2: U1.34(PB13) ; port PWR_SW_2
SWCLK: P1.2 U1.49(PA14(JTCK-SWCLK))
SWDIO: P1.4 U1.46(PA13(JTMS-SWDIO))
SYNC_CHRGR: U1.11(PC3) ; port SYNC_CHRGR
USER_BUTTON_0: R9.2 SW2.B1 SW2.B2 U1.2(PC13)
USER_BUTTON_1: R10.2 SW3.B1 SW3.B2 U1.3(PC14-OSC32_IN)
USER_LED: U1.54(PD2) ; port USER_LED
USRB0_NDB: C9.2 R6.1 R9.1
USRB1_NDB: C10.2 R7.1 R10.1
VBAT1_DIV: R1.1 R3.2 U1.15(PA1)
VBAT2_DIV: R2.1 R4.2 U1.16(PA2)
VCAP_1: C14.2 U1.31(VCAP_1)
VCAP_2: C13.2 U1.47(VCAP_2)
NetC1_1: C1.1 C2.1 C3.1 C4.1 C5.1 C6.1 U1.12(VSSA) U1.18(VSS) U1.63(VSS)
NetC11_1: C11.1 C12.1 C13.1 C14.1 R11.1
NetP2_3: U1.29(PB10) ; port TX
NetP2_4: U1.30(PB11) ; port RX
NetU1_24: U1.24(PC4) ; port PG_3.3V

Not connected (* = marked no-connect by the designer): P1 3*

### Notes on the sheet
- DWG. NO.
- REV.
- SHT.
- THIS DOCUMENT AND THE DATA DISCLOSED HEREIN OR HEREWITH IS THE PROPERTY OF ALTIUM LIMITED AND MAY BE FREELY DISTRIBUTED IN WHOLE. NO RIGHTS ARE RESERVED OR EXPRESS OR IMPLIED WARANTEE GIVEN.
- REVISION
- DESCRIPTION
- DATE
- APPROVED
- ENG:
- APPROVALS
- PROJECT
- DSN:
- CHK:
- REFERENCE DOCUMENTS
- PROJECT REVISION:
- TITLE
- DOCUMENT REVISION:
- DESIGN ITEM:
- BOM:
- FAB DWG:
- PCB DWG:
- ASSY DWG:
- SCALE:
- SIZE
- B
- CAGE CODE
- FILE NAME
- DWG NO.
- SHEET
- OF
- REV

### Library data of the parts
C1-C14 = Cap Non-Pol SMD: Capacitor
L1 = 02080547520600: Inductor SMD, size 0805, 4.7 uH, 600 mA; Manufacturer: TDK; Manufacturer Part Number: MLZ2012N4R7LTD25; Inductance: 4.7 uH; Tolerance: 20%; Maximum DC Current: 600 mA; Maximum DC Resistance: 180 mOhms; Saturation Current: 130 mA; Packaging: Tape and Reel; Supplier 1 URL: https://www.mouser.vn/ProductDetail/TDK/MLZ2012N4R7LTD25?qs=u4%252BEJ9urDASpSZamVZFpmA%3D%3D; Supplier 2 URL: https://www.digikey.com/en/products/detail/tdk-corporation/MLZ2012N4R7LTD25/4743199; Supplier 3 URL: N/A; ComponentLink1Description: Datasheet; ComponentLink1URL: https://product.tdk.com/system/files/dam/doc/product/inductor/inductor/smd/catalog/inductor_automotive_decoupling_mlz2012_en.pdf?ref_disty=mouser; Value: 4.7 uH, 600 mA; Mount: SMD/SMT; Operating Temperature Max: + 125 C; Operating Temperature Min: - 55 C; Package / Case: 0805; Supplier 1: Mouser; Supplier 1 Part Number: 810-MLZ2012N4R7LTD25; Supplier 2: Digi-Key; Supplier 2 Part Number: 445-16383-2-ND; Supplier 3: thegioiic; Supplier 3 Part Number: OEM
P1 = 62401021722: WR-WTB THT Male Horizontal Shrouded Header with positive locking, Dual Row, pitch 2mm, 10p; Manufacturer: Wurth Elektronik; Pin Number: 10; Contact Resistance: 20mOhm; Rated Current: 3A; Withstanding Voltage: 1000VAC; Working Voltage: 250VAC; ComponentLink1Description: Datasheet; ComponentLink1URL: https://www.we-online.com/catalog/datasheet/62401021722.pdf; Pitch: 2mm; Packaging: Tube; Part Number: 62401021722; Gender: Male; Type: Horizontal; Supplier 1 URL: https://www.mouser.vn/ProductDetail/Wurth-Elektronik/62401021722?qs=E2PpAYvlWVt1BydIyo7tzQ%3D%3D; Supplier 2 URL: N/A; Supplier 3 URL: N/A; Value: 2A, 125V(AC); LCSC Part #: N/A; Manufacturer Part Number: 62401021722; Mount: THT; Operating Temperature Max: + 85 C; Operating Temperature Min: - 25 C; Package / Case: 10; Supplier 1: Mouser; Supplier 1 Part Number: 710-62401021722; Supplier 2: Digi-Key; Supplier 2 Part Number: N/A; Supplier 3: thegioiic; Supplier 3 Part Number: N/A
R1-R11 = RESISTOR SMD: Resistor
SW1-SW3 = 430152050826: WS-TASV SMT Tact Switch, L6 x W6 x H5mm, 260g, SPST-NO, 12V, 50mA; Manufacturer: Wurth Elektronik; Washable: No; Rated Voltage: 12VDC; Manufacturer Part Number: 430152050826; Category: Tact Switches; Match Code: WS-TASV; Mount: Surface Mount; Operating Temperature Max: 85°C; Operating Temperature Min: -40°C; Packaging: Tape and Reel; Length: 6mm; Width: 6mm; Height: 5mm; Circuit: SPST-NO; Contact Material: Stainless Steel; Operation Force: 260g; Rated Current: 50mA; Terminal Material: Copper Alloy; Terminal Plating: Silver; Supplier 1 URL: https://www.mouser.vn/ProductDetail/Wurth-Elektronik/430152050826?qs=wr8lucFkNMXbUWez0eOAow%3D%3D; Supplier 2 URL: https://www.digikey.com/en/products/detail/w%C3%BCrth-elektronik/430152050826/5208996; Supplier 3 URL: https://www.thegioiic.com/nut-nhan-6x6mm-cao-5mm-4-chan-smd; LCSC Part #: N/A; ComponentLink1Description: Datasheet; ComponentLink1URL: https://www.we-online.com/redexpert/spec/430152050826?ad; Package / Case: 0805; Supplier 1: Mouser; Supplier 1 Part Number: 710-430152050826; Supplier 2: Digi-Key; Supplier 2 Part Number: 732-6993-2-ND; Supplier 3: thegioiic; Supplier 3 Part Number: OEM; Value: 430152050826
Y1 = 071105086016: WE-XTAL Quartz Crystal, SMT, HC49/4HSMX, 8MHz, +/-30ppm; Manufacturer Part Number: 830003151; Manufacturer: Wurth Elektronik; Frequency Stability: +/-50ppm; Load Capacitance: 16pF; Frequency: 8MHz; Frequency Tolerance: +/-30ppm; Supplier 3 URL: https://www.thegioiic.com/thach-anh-8mhz-2-chan-smd-hc49-s; ComponentLink1Description: Datasheet; ComponentLink1URL: https://katalog.we-online.com/pbs/datasheet/830003151.pdf; Supplier 1 URL: https://www.mouser.com/ProductDetail/Wurth-Elektronik/830003151?qs=2WXlatMagcHisY7XHApyYg%3D%3D; Supplier 2 URL: https://www.digikey.com/en/products/detail/w%C3%BCrth-elektronik/830003151/13979296; Value: 8MHz; Mount: SMD/SMT; Operating Temperature Max: + 60 C; Operating Temperature Min: - 10 C; Package / Case: HC49/4HSMX; Packaging: Tape and Reel; Supplier 1: Mouser; Supplier 1 Part Number: 710-830003151; Supplier 2: Digi-Key; Supplier 2 Part Number: 732-830003151TR-ND; Supplier 3: thegioiic; Supplier 3 Part Number: N/A

## Sheet Buck_Boost_Converter_A.SchDoc
size A4; SheetNumber: 7; SheetTotal: 10
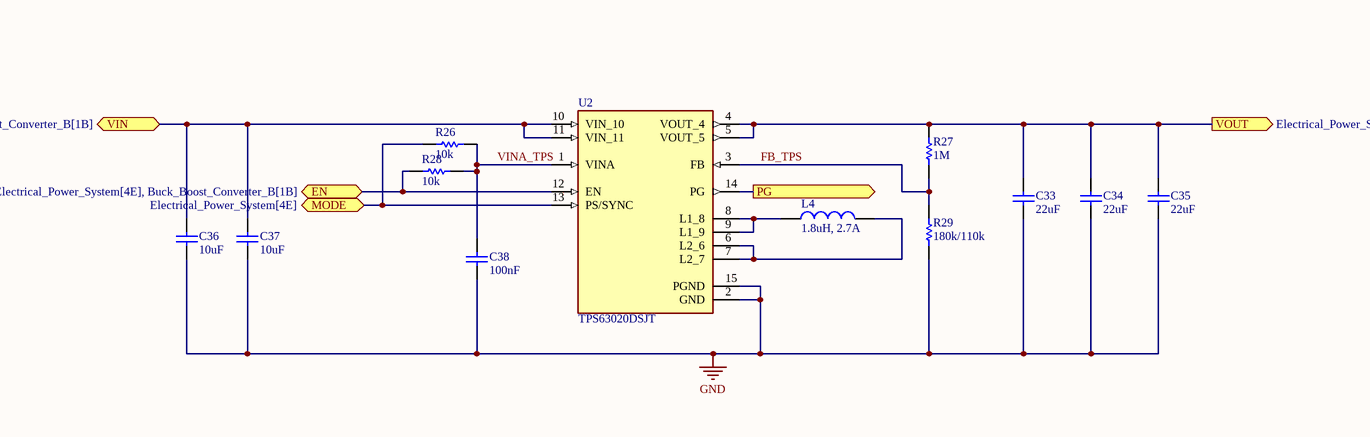
[diagram p8: Buck_Boost_Converter_A.SchDoc, left]
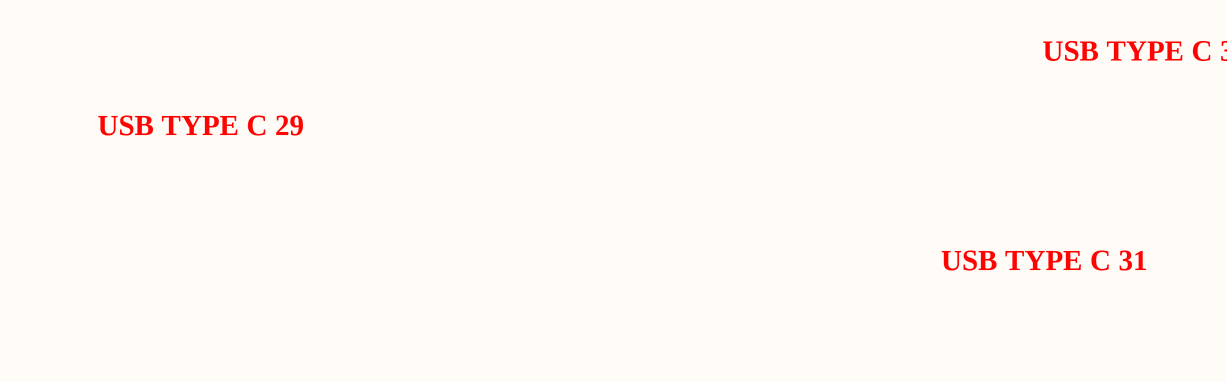
[diagram p9: Buck_Boost_Converter_A.SchDoc, right]

### Parts
C33  value 22uF  [CAP-SM-0603]  (hidden comment: Cap Non-Pol SMD)
C34  value 22uF  [CAP-SM-0603]  (hidden comment: Cap Non-Pol SMD)
C35  value 22uF  [CAP-SM-0603]  (hidden comment: Cap Non-Pol SMD)
C36  value 10uF  [CAP-SM-0603]  (hidden comment: Cap Non-Pol SMD)
C37  value 10uF  [CAP-SM-0603]  (hidden comment: Cap Non-Pol SMD)
C38  value 100nF  [CAP-SM-0603]  (hidden comment: Cap Non-Pol SMD)
L4  1.8uH, 2.7A  [WE-PD2A_4532]
R26  value 10k  [RES-SM-0603]  (hidden comment: RESISTOR SMD)
R27  value 1M  [RES-SM-0603]  (hidden comment: RESISTOR SMD)
R28  value 10k  [RES-SM-0603]  (hidden comment: RESISTOR SMD)
R29  value 180k/110k  [RES-SM-0603]  (hidden comment: RESISTOR SMD)
U2  TPS63020DSJT  [IC_TPS63020DSJT]

### Ports
EN (bidir, see Electrical_Power_System[4E], Buck_Boost_Converter_B[1B]), MODE (bidir, see Electrical_Power_System[4E]), PG (out, see Electrical_Power_System[4E]), VIN (bidir, see Electrical_Power_System[4E], Buck_Boost_Converter_B[1B]), VOUT (out, see Electrical_Power_System[3E])

### Nets
5V: C33.2 C34.2 C35.2 R27.2 U2.4(VOUT_4) U2.5(VOUT_5) ; port VOUT
GND: C33.1 C34.1 C35.1 C36.1 C37.1 C38.1 R29.1 U2.2(GND) U2.15(PGND)
VBUS: C36.2 C37.2 U2.10(VIN_10) U2.11(VIN_11) ; port VIN
EN_5V_3.3V: R28.2 U2.12(EN) ; port EN
FB_TPS: R27.1 R29.2 U2.3(FB)
MODE_5V: R26.2 U2.13(PS/SYNC) ; port MODE
PG_5V: U2.14(PG) ; port PG
VINA_TPS: C38.2 R26.1 R28.1 U2.1(VINA)
NetL4_1: L4.1 U2.8(L1_8) U2.9(L1_9)
NetL4_2: L4.2 U2.6(L2_6) U2.7(L2_7)

### Notes on the sheet
- USB TYPE C 30
- USB TYPE C 29
- USB TYPE C 31

### Library data of the parts
C33-C38 = Cap Non-Pol SMD: Capacitor
L4 = 784773018: as L5 on sheet Buck_Boost_Converter_B; ComponentLink1Description: Datasheet; ComponentLink1URL: https://www.we-online.com/catalog/datasheet/784773018.pdf; Manufacturer Part Number: 784773018; Published Date: May 2020; Rated Current: 2.7A; Inductance: 1.8uH; Operating Temperature: -40 to +125degC; Packaging: Tape and Reel; Size: 4532; Supplier 2 URL: https://www.digikey.com/en/products/detail/w%C3%BCrth-elektronik/784773018/5168841?s=N4IgTCBcDaIOwA4Asc4GYAMBGBIC6AvkA; Supplier 1 URL: https://www.mouser.vn/ProductDetail/Wurth-Elektronik/784773018?qs=sBf%2Fb4nBSleQ5H1IVXBHSg%3D%3D; Supplier 3 URL: N/A; Value: 1.8uH, 2.7A; LCSC Part #: N/A; Supplier 1: Mouser; Supplier 1 Part Number: 710-784773018; Supplier 2: Digi-Key; Supplier 2 Part Number: 732-6804-2-ND; Supplier 3: thegioiic; Supplier 3 Part Number: N/A; Mount: SMD/SMT
R26-R29 = RESISTOR SMD: Resistor
U2 = TPS63020DSJT: as U3 on sheet Buck_Boost_Converter_B; Value: *; SnapEDA_Link: https://www.snapeda.com/parts/TPS63020DSJT/Texas%20Instruments/view-part/225125/?ref=snap; Texas_Instruments-Purchase-URL: https://snapeda.com/shop?store=Texas+Instruments&id=225125; Arrow_Asia-Purchase-URL: https://snapeda.com/shop?store=Arrow+Asia&id=225125; Mouser-Purchase-URL: https://snapeda.com/shop?store=Mouser&id=225125; Availability: Good; Price: None; Package: VSON-14 Texas Instruments; DigiKey-Purchase-URL: https://snapeda.com/shop?store=DigiKey&id=225125; MP: TPS63020DSJT

## Sheet MPPT_CC_CV_Charger_B.SchDoc
size A4; SheetNumber: 3; SheetTotal: 10
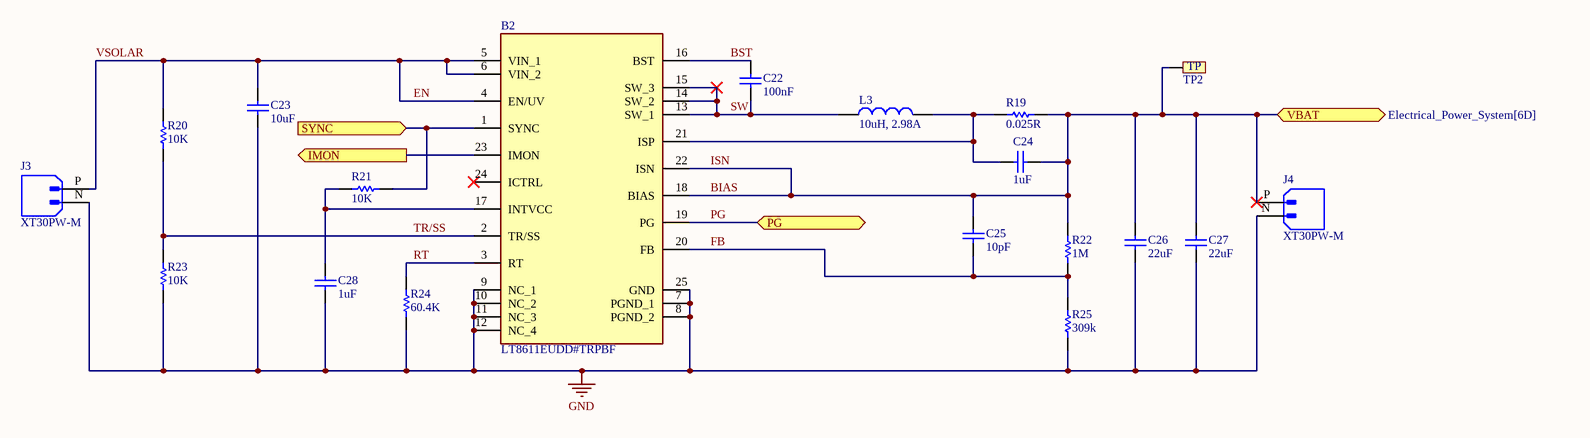
[diagram p10: MPPT_CC_CV_Charger_B.SchDoc]

### Parts
B2  LT8611EUDD#TRPBF  [QFN50P300X500X80-25N-D]
C22  value 100nF  [CAP-SM-0603]  (hidden comment: Cap Non-Pol SMD)
C23  value 10uF  [CAP-SM-0603]  (hidden comment: Cap Non-Pol SMD)
C24  value 1uF  [CAP-SM-0603]  (hidden comment: Cap Non-Pol SMD)
C25  value 10pF  [CAP-SM-0603]  (hidden comment: Cap Non-Pol SMD)
C26  value 22uF  [CAP-SM-0603]  (hidden comment: Cap Non-Pol SMD)
C27  value 22uF  [CAP-SM-0603]  (hidden comment: Cap Non-Pol SMD)
C28  value 1uF  [CAP-SM-0603]  (hidden comment: Cap Non-Pol SMD)
J3  XT30PW-M  [AMASS_XT30PW-M]
J4  XT30PW-M  [AMASS_XT30PW-M]
L3  10uH, 2.98A  [WE-PD2A_1054]
R19  value 0.025R  [RES-SM-0603]  (hidden comment: RESISTOR SMD)
R20  value 10K  [RES-SM-0603]  (hidden comment: RESISTOR SMD)
R21  value 10K  [RES-SM-0603]  (hidden comment: RESISTOR SMD)
R22  value 1M  [RES-SM-0603]  (hidden comment: RESISTOR SMD)
R23  value 10K  [RES-SM-0603]  (hidden comment: RESISTOR SMD)
R24  value 60.4K  [RES-SM-0603]  (hidden comment: RESISTOR SMD)
R25  value 309k  [RES-SM-0603]  (hidden comment: RESISTOR SMD)
TP2  Test Point  [TP]  (value not drawn)

### Ports
IMON (out, see Electrical_Power_System[7D]), PG (bidir, see Electrical_Power_System[7D]), SYNC (in, see Electrical_Power_System[7D], MPPT_CC_CV_Charger_A[1B]), VBAT (bidir, see Electrical_Power_System[6D])

### Nets
GND: B2.7(PGND_1) B2.8(PGND_2) B2.9(NC_1) B2.10(NC_2) B2.11(NC_3) B2.12(NC_4) B2.25(GND) C23.1 C26.1 C27.1 C28.1 J3.N J4.N R23.1 R24.1 R25.1
BIAS: B2.18(BIAS) B2.22(ISN) C24.1 C25.2 C26.2 C27.2 J4.P R19.1 R22.2 TP2.TP1 ; port VBAT  [also labelled ISN]
BST: B2.16(BST) C22.2
EN: B2.4(EN/UV) B2.5(VIN_1) B2.6(VIN_2) C23.2 J3.P R20.2  [also labelled VSOLAR]
FB: B2.20(FB) C25.1 R22.1 R25.2
IMON1: B2.23(IMON) ; port IMON
PG: B2.19(PG) ; port PG
RT: B2.3(RT) R24.2
SW: B2.13(SW_1) B2.14(SW_2) B2.15(SW_3) C22.1 L3.1
SYNC_CHRGR: B2.1(SYNC) R21.1 ; port SYNC
TR/SS: B2.2(TR/SS) R20.1 R23.2
NetB2_17: B2.17(INTVCC) C28.2 R21.2
NetB2_21: B2.21(ISP) C24.2 L3.2 R19.2

Not connected (* = marked no-connect by the designer): B2 24(ICTRL)*

### Notes on the sheet
- (in symbol Test Point) TP

### Library data of the parts
B2 = LT8611EUDD#TRPBF: as B1 on sheet MPPT_CC_CV_Charger_A; Mouser Part Number: 584-LT8611EUDD#TRPBF; Mouser Price/Stock: https://www.mouser.co.uk/ProductDetail/Analog-Devices/LT8611EUDDTRPBF?qs=hVkxg5c3xu8xYINPiSHe4g%3D%3D; Manufacturer_Part_Number: LT8611EUDD#TRPBF; Datasheet Link: https://www.analog.com/LT8611/datasheet
C22-C28 = Cap Non-Pol SMD: Capacitor
J3 J4 = XT30PW-M: as J1 on sheet MPPT_CC_CV_Charger_A; SnapEDA_Link: https://www.snapeda.com/parts/XT30PW-M/AMASS/view-part/?ref=snap; Package: None; Value: *; MP: XT30PW-M; Check_prices: https://www.snapeda.com/parts/XT30PW-M/AMASS/view-part/?ref=eda
L3 = 78477610: as L2 on sheet MPPT_CC_CV_Charger_A; ComponentLink1Description: Datasheet; ComponentLink1URL: https://www.we-online.com/catalog/datasheet/78477610.pdf; Manufacturer Part Number: 78477610; Published Date: May 2020; Rated Current: 2.98A; Inductance: 10uH; Operating Temperature: -40 to +125degC; Packaging: Tape and Reel; Size: 1054; Supplier 1 URL: https://www.digikey.com/en/products/detail/w%C3%BCrth-elektronik/78477610/5168783?s=N4IgjCBcoGwJxVAYygMwIYBsDOBTANCAPZQDaIALAAxwDMdIAuoQA4AuUIAymwE4CWAOwDmIAL6EwAJjgRoIFJAw4CxMiADsYMBQAcTVh0jc%2BQ0RJBSqujYgVoseQiUjkwVAAQBWgBIGQ7JwAqoL8bADyqACyuOjYAK68uOKEVrr68orKTmqulgB0cLoeAIL%2BgcYhYZExcYnJYo1AA; Supplier 1 URL: https://www.mouser.vn/ProductDetail/Wurth-Elektronik/78477610?qs=sBf%2Fb4nBSlfmBIqyB8oiaA%3D%3D; Supplier 3 URL: N/A; Value: 10uH, 2.98A; Supplier 2 URL: N/A; LCSC Part #: N/A; Mount: SMD/SMT; Supplier 1: Mouser; Supplier 1 Part Number: 710-78477610; Supplier 2: Digi-Key; Supplier 2 Part Number: 732-6881-2-ND; Supplier 3: thegioiic; Supplier 3 Part Number: N/A
R19-R25 = RESISTOR SMD: Resistor

## Nets that join several sheets
3.3V: Board-to-Board_Connector (P2.1 P2.2), Buck_Boost_Converter_B (6 pins), LED_Connector (D2.1 TP3.TP1), MicroController (17 pins)
5V: Board-to-Board_Connector (U4.2 U4.4), LED_Connector (D3.1 TP4.TP1), MicroController (P1.9 P1.10), Buck_Boost_Converter_A (6 pins)
GND: Board-to-Board_Connector (8 pins), MPPT_CC_CV_Charger_A (16 pins), Ideal_Diode_B (B4.2 B4.3 C31.1 C32.1), Ideal_Diode_A (B3.2 B3.3 C29.1 C30.1), Buck_Boost_Converter_B (9 pins), LED_Connector (R34.2 R35.2 R36.2), MicroController (14 pins), Buck_Boost_Converter_A (9 pins), MPPT_CC_CV_Charger_B (16 pins)
VBUS: Ideal_Diode_B (5 pins), Ideal_Diode_A (5 pins), Buck_Boost_Converter_B (C42.2 C43.2 U3.10 U3.11), LED_Connector (J5.2 J5.4), Buck_Boost_Converter_A (C36.2 C37.2 U2.10 U2.11)
BIAS: MPPT_CC_CV_Charger_A (10 pins), Ideal_Diode_B (6 pins), MicroController (R2.2)
BIAS: Ideal_Diode_A (6 pins), MicroController (R1.2), MPPT_CC_CV_Charger_B (10 pins)
EN_5V_3.3V: Buck_Boost_Converter_B (R32.2 U3.12), LED_Connector (J5.1), Buck_Boost_Converter_A (R28.2 U2.12)
IMON1: MicroController (U1.9), MPPT_CC_CV_Charger_B (B2.23)
IMON2: MPPT_CC_CV_Charger_A (B1.23), MicroController (U1.10)
MODE_3.3V: Buck_Boost_Converter_B (R30.2 U3.13), MicroController (U1.25)
MODE_5V: MicroController (U1.28), Buck_Boost_Converter_A (R26.2 U2.13)
NetP2_3: Board-to-Board_Connector (P2.3), MicroController (U1.29)
NetP2_4: Board-to-Board_Connector (P2.4), MicroController (U1.30)
NetU1_24: Buck_Boost_Converter_B (U3.14), MicroController (U1.24)
PG: MPPT_CC_CV_Charger_A (B1.19), MicroController (U1.59)
PG: MicroController (U1.58), MPPT_CC_CV_Charger_B (B2.19)
PG_5V: MicroController (U1.27), Buck_Boost_Converter_A (U2.14)
POWER_sw1: LED_Connector (R37.1 R38.1), MicroController (U1.35)
POWER_sw2: LED_Connector (R39.1 R40.1), MicroController (U1.34)
SYNC_CHRGR: MPPT_CC_CV_Charger_A (B1.1 R14.1), MicroController (U1.11), MPPT_CC_CV_Charger_B (B2.1 R21.1)
USER_LED: LED_Connector (D1.1), MicroController (U1.54)